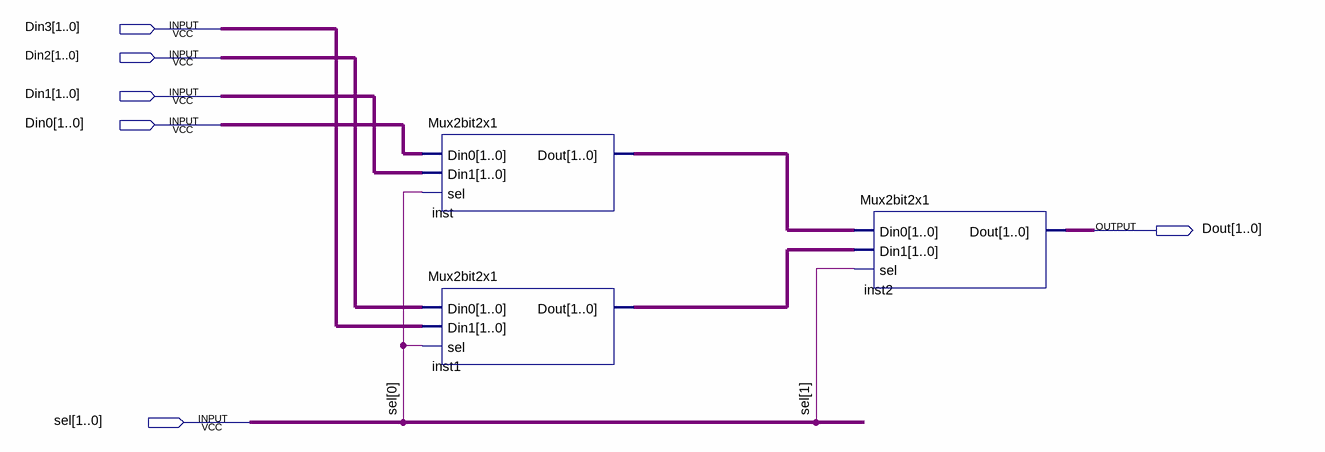
[diagram p0: schematic sheet]
// Quartus schematic Mux2bit4x1.bdf as structural Verilog: 3 symbols, 6 pins
module Mux2bit4x1 (
  input  [1:0] Din3,
  input  [1:0] Din2,
  input  [1:0] Din1,
  input  [1:0] Din0,
  input  [1:0] sel,
  output [1:0] Dout
);

  wire [1:0] inst1_dout, inst_dout;

  Mux2bit2x1 inst (.Din0(Din0), .Din1(Din1), .sel(sel[0]), .Dout(inst_dout));
  Mux2bit2x1 inst1 (.Din0(Din2), .Din1(Din3), .sel(sel[0]), .Dout(inst1_dout));
  Mux2bit2x1 inst2 (.Din0(inst_dout), .Din1(inst1_dout), .sel(sel[1]), .Dout(Dout));
endmodule
